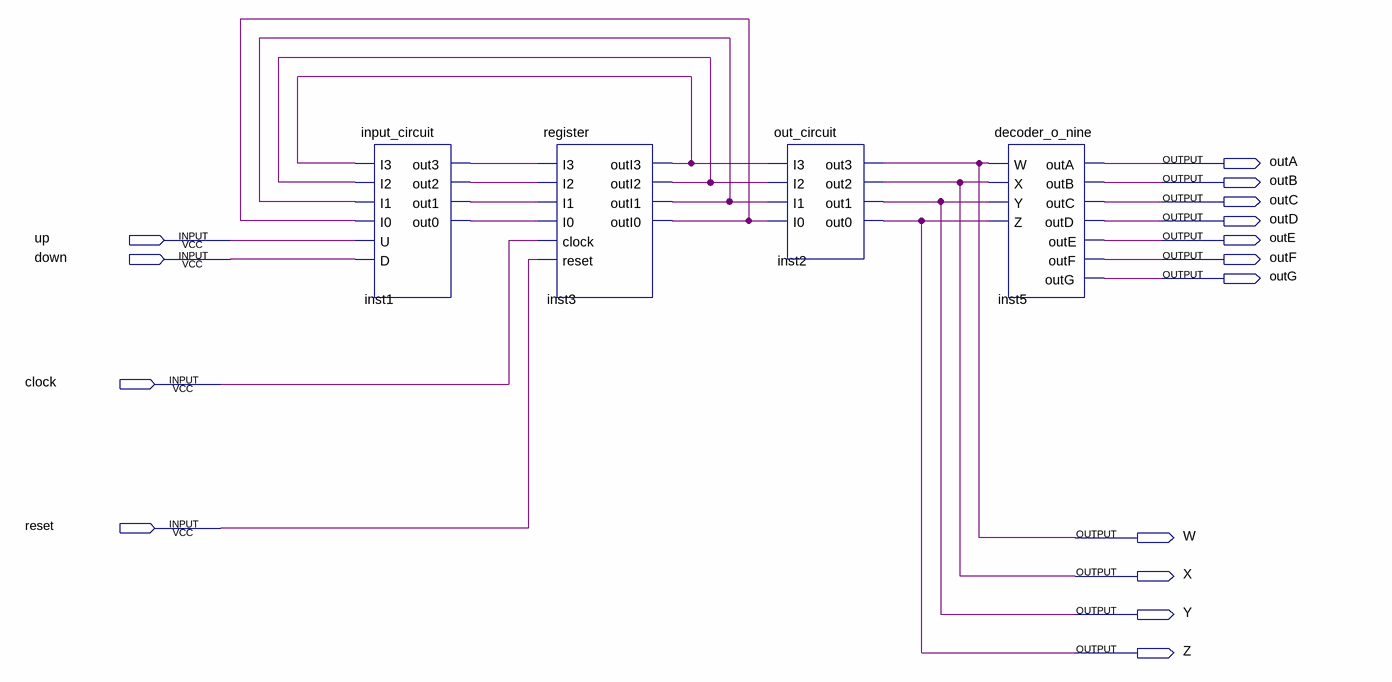
[diagram p0: schematic sheet]
// Quartus schematic state_machine.bdf as structural Verilog: 4 symbols, 15 pins
module state_machine (
  input  up,
  input  down,
  input  clock,
  input  reset,
  output outA,
  output outB,
  output outC,
  output outD,
  output outE,
  output outF,
  output outG,
  output W,
  output X,
  output Y,
  output Z
);

  wire inst1_out0, inst1_out1, inst1_out2, inst1_out3, inst3_outi0, inst3_outi1, inst3_outi2, inst3_outi3;

  input_circuit inst1 (
    .I3(inst3_outi3), .I2(inst3_outi2), .I1(inst3_outi1), .I0(inst3_outi0), .U(up), .D(down),
    .out3(inst1_out3), .out2(inst1_out2), .out1(inst1_out1), .out0(inst1_out0));
  register inst3 (
    .I3(inst1_out3), .I2(inst1_out2), .I1(inst1_out1), .I0(inst1_out0), .clock(clock), .reset(reset),
    .outI3(inst3_outi3), .outI2(inst3_outi2), .outI1(inst3_outi1), .outI0(inst3_outi0));
  out_circuit inst2 (
    .I3(inst3_outi3), .I2(inst3_outi2), .I1(inst3_outi1), .I0(inst3_outi0), .out3(W), .out2(X), .out1(Y),
    .out0(Z));
  decoder_o_nine inst5 (
    .W(W), .X(X), .Y(Y), .Z(Z), .outA(outA), .outB(outB), .outC(outC), .outD(outD), .outE(outE), .outF(outF),
    .outG(outG));
endmodule
